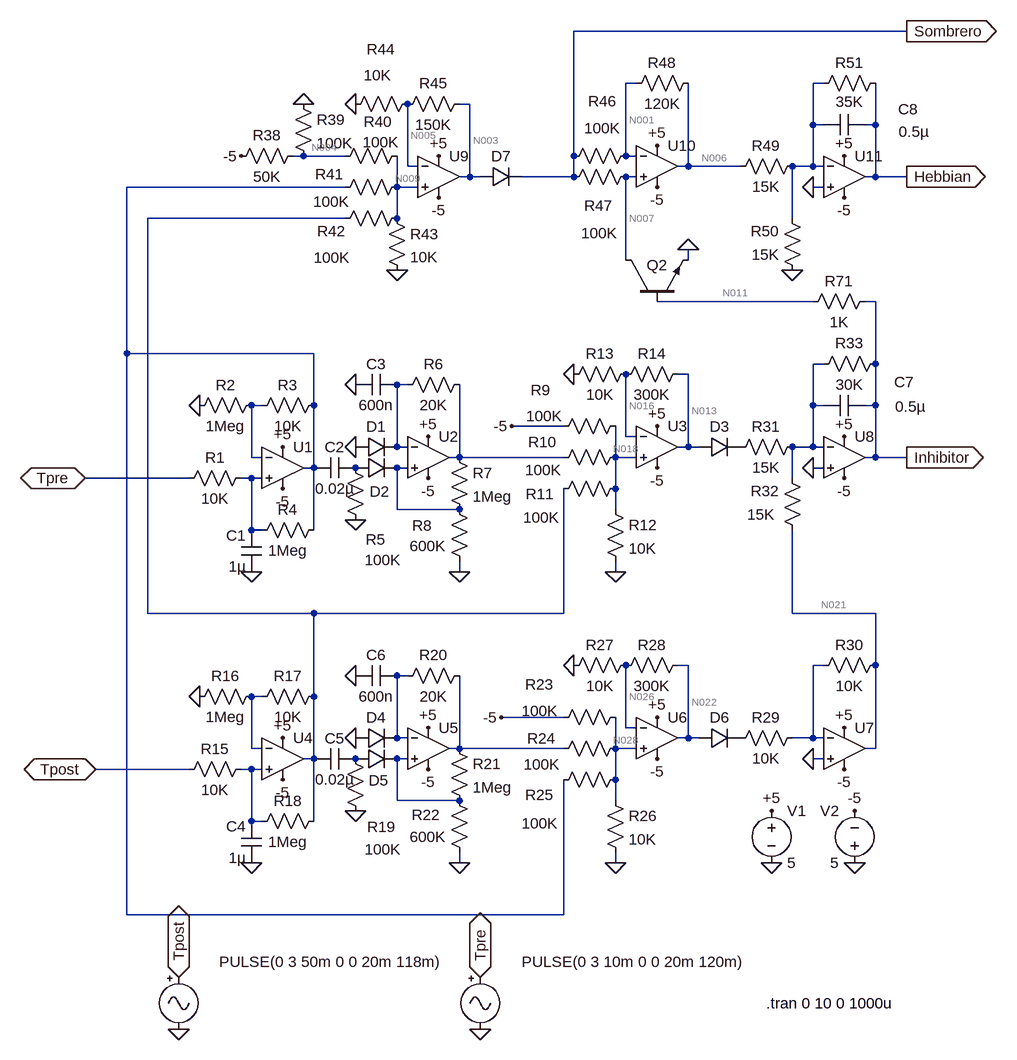
[diagram p0: schematic In-Ex-Pulse.asc]
In-Ex-Pulse.asc, the LTspice schematic file:
Version 4
SHEET 1 2784 1552
WIRE 1184 -672 672 -672
WIRE 768 -592 752 -592
WIRE 1056 -592 1040 -592
WIRE 512 -560 496 -560
WIRE 1040 -528 1040 -592
WIRE 1056 -528 1040 -528
WIRE 1136 -528 1136 -592
WIRE 1136 -528 1120 -528
WIRE 256 -480 240 -480
WIRE 320 -480 256 -480
WIRE 672 -480 672 -672
WIRE 752 -480 752 -592
WIRE 768 -480 752 -480
WIRE 416 -464 416 -560
WIRE 432 -464 416 -464
WIRE 848 -464 848 -592
WIRE 848 -464 832 -464
WIRE 928 -464 848 -464
WIRE 1040 -464 1040 -528
WIRE 1040 -464 1008 -464
WIRE 1056 -464 1040 -464
WIRE 512 -448 512 -560
WIRE 512 -448 496 -448
WIRE 528 -448 512 -448
WIRE 672 -448 672 -480
WIRE 672 -448 592 -448
WIRE 768 -448 752 -448
WIRE 1136 -448 1136 -528
WIRE 1136 -448 1120 -448
WIRE 1184 -448 1136 -448
WIRE 320 -432 -16 -432
WIRE 400 -432 400 -480
WIRE 432 -432 400 -432
WIRE 1056 -432 1040 -432
WIRE 320 -384 16 -384
WIRE 400 -384 400 -432
WIRE 1008 -384 1008 -464
WIRE 752 -320 752 -448
WIRE 848 -320 848 -336
WIRE 1040 -256 800 -256
WIRE 1136 -256 1120 -256
WIRE -16 -176 -16 -432
WIRE 272 -176 -16 -176
WIRE 1056 -160 1040 -160
WIRE 1136 -160 1136 -256
WIRE 848 -144 832 -144
WIRE 416 -128 400 -128
WIRE 192 -96 176 -96
WIRE 272 -96 272 -176
WIRE 1040 -96 1040 -160
WIRE 1056 -96 1040 -96
WIRE 1136 -96 1136 -160
WIRE 1136 -96 1120 -96
WIRE 656 -64 576 -64
WIRE 752 -48 752 -144
WIRE 768 -48 752 -48
WIRE 400 -32 400 -128
WIRE 416 -32 400 -32
WIRE 848 -32 848 -144
WIRE 848 -32 832 -32
WIRE 864 -32 848 -32
WIRE 1040 -32 1040 -96
WIRE 1040 -32 1008 -32
WIRE 1056 -32 1040 -32
WIRE 176 -16 176 -96
WIRE 192 -16 176 -16
WIRE 496 -16 496 -128
WIRE 496 -16 480 -16
WIRE 656 -16 496 -16
WIRE 736 -16 736 -64
WIRE 768 -16 736 -16
WIRE 1136 -16 1136 -96
WIRE 1136 -16 1120 -16
WIRE 1184 -16 1136 -16
WIRE 272 0 272 -96
WIRE 272 0 256 0
WIRE 416 0 400 0
WIRE 1056 0 1040 0
WIRE 80 16 -80 16
WIRE 176 16 160 16
WIRE 192 16 176 16
WIRE 1008 16 1008 -32
WIRE 736 32 736 -16
WIRE 400 64 400 0
WIRE 496 64 400 64
WIRE 736 64 736 32
WIRE 176 96 176 16
WIRE 192 96 176 96
WIRE 272 96 272 0
WIRE 496 160 496 144
WIRE 736 160 736 144
WIRE 16 224 16 -384
WIRE 272 224 16 224
WIRE 656 224 656 32
WIRE 656 224 272 224
WIRE 1008 224 1008 96
WIRE 1136 224 1008 224
WIRE 848 304 832 304
WIRE 1056 304 1040 304
WIRE 1136 304 1136 224
WIRE 416 320 400 320
WIRE 192 352 176 352
WIRE 272 352 272 224
WIRE 656 384 560 384
WIRE 752 400 752 304
WIRE 768 400 752 400
WIRE 400 416 400 320
WIRE 416 416 400 416
WIRE 848 416 848 304
WIRE 848 416 832 416
WIRE 864 416 848 416
WIRE 1040 416 1040 304
WIRE 1040 416 1008 416
WIRE 1056 416 1040 416
WIRE 176 432 176 352
WIRE 192 432 176 432
WIRE 496 432 496 320
WIRE 496 432 480 432
WIRE 656 432 496 432
WIRE 736 432 736 384
WIRE 768 432 736 432
WIRE 1136 432 1136 304
WIRE 1136 432 1120 432
WIRE 272 448 272 352
WIRE 272 448 256 448
WIRE 416 448 400 448
WIRE 1056 448 1040 448
WIRE 80 464 -64 464
WIRE 176 464 160 464
WIRE 192 464 176 464
WIRE 736 480 736 432
WIRE 400 512 400 448
WIRE 496 512 400 512
WIRE 736 512 736 480
WIRE 176 544 176 464
WIRE 192 544 176 544
WIRE 272 544 272 448
WIRE 496 608 496 592
WIRE 736 608 736 592
WIRE -16 688 -16 -176
WIRE 656 688 656 480
WIRE 656 688 -16 688
FLAG 800 -64 +5
FLAG 800 0 -5
FLAG 528 864 0
FLAG 64 864 0
FLAG 224 -32 +5
FLAG 224 32 -5
FLAG 448 -48 +5
FLAG 448 16 -5
FLAG 336 -32 0
FLAG 336 -128 0
FLAG 336 80 0
FLAG 672 -144 0
FLAG 576 -64 -5
FLAG 448 400 +5
FLAG 448 464 -5
FLAG 336 416 0
FLAG 336 320 0
FLAG 336 528 0
FLAG 496 608 0
FLAG 496 160 0
FLAG 800 384 +5
FLAG 800 448 -5
FLAG 672 304 0
FLAG 560 384 -5
FLAG 176 160 0
FLAG 96 -96 0
FLAG 224 416 +5
FLAG 224 480 -5
FLAG 176 608 0
FLAG 96 352 0
FLAG 1088 -48 +5
FLAG 1088 16 -5
FLAG 1088 400 +5
FLAG 1088 464 -5
FLAG 1040 448 0
FLAG 1040 0 0
FLAG 736 160 0
FLAG 736 608 0
FLAG 1184 -16 Inhibitor
IOPIN 1184 -16 Out
FLAG 464 -480 +5
FLAG 464 -416 -5
FLAG 336 -560 0
FLAG 256 -560 0
FLAG 800 -496 +5
FLAG 800 -432 -5
FLAG 160 -480 -5
FLAG 1088 -480 +5
FLAG 1088 -416 -5
FLAG 1040 -432 0
FLAG 1008 -304 0
FLAG 848 -336 0
FLAG 1184 -448 Hebbian
IOPIN 1184 -448 Out
FLAG 1184 -672 Sombrero
IOPIN 1184 -672 Out
FLAG 976 608 0
FLAG 1104 608 0
FLAG 1104 528 -5
FLAG 976 528 +5
FLAG -64 464 Tpost
IOPIN -64 464 BiDir
FLAG 64 784 Tpost
IOPIN 64 784 BiDir
FLAG -80 16 Tpre
IOPIN -80 16 BiDir
FLAG 528 784 Tpre
IOPIN 528 784 BiDir
FLAG 400 -304 0
SYMBOL Opamps\\UniversalOpamp2 800 -32 R0
SYMATTR InstName U3
SYMBOL res 848 -160 R90
WINDOW 0 0 56 VBottom 2
WINDOW 3 32 56 VTop 2
SYMATTR InstName R14
SYMATTR Value 300K
SYMBOL res 720 48 R0
SYMATTR InstName R12
SYMATTR Value 10K
SYMBOL res 752 -32 R90
WINDOW 0 8 128 VBottom 2
WINDOW 3 20 127 VTop 2
SYMATTR InstName R10
SYMATTR Value 100K
SYMBOL Opamps\\UniversalOpamp2 224 0 R0
SYMATTR InstName U1
SYMBOL cap 192 160 R180
WINDOW 0 24 56 Left 2
WINDOW 3 24 8 Left 2
SYMATTR InstName C1
SYMATTR Value 1µ
SYMBOL res 176 0 R90
WINDOW 0 0 56 VBottom 2
WINDOW 3 32 56 VTop 2
SYMATTR InstName R1
SYMATTR Value 10K
SYMBOL res 176 448 R90
WINDOW 0 0 56 VBottom 2
WINDOW 3 32 56 VTop 2
SYMATTR InstName R15
SYMATTR Value 10K
SYMBOL res 288 -112 R90
WINDOW 0 0 56 VBottom 2
WINDOW 3 32 56 VTop 2
SYMATTR InstName R3
SYMATTR Value 10K
SYMBOL res 752 16 R90
WINDOW 0 40 132 VBottom 2
WINDOW 3 45 130 VTop 2
SYMATTR InstName R11
SYMATTR Value 100K
SYMBOL Opamps\\UniversalOpamp2 448 -16 R0
SYMATTR InstName U2
SYMBOL diode 336 -16 R270
WINDOW 0 32 32 VTop 2
WINDOW 3 0 32 Invisible 2
SYMATTR InstName D1
SYMBOL diode 336 16 R270
WINDOW 0 -36 37 VTop 2
WINDOW 3 0 32 Invisible 2
SYMATTR InstName D2
SYMBOL res 480 -32 R0
SYMATTR InstName R7
SYMATTR Value 1Meg
SYMBOL res 512 160 R180
WINDOW 0 58 71 Left 2
WINDOW 3 36 40 Left 2
SYMATTR InstName R8
SYMATTR Value 600K
SYMBOL res 320 -16 R0
WINDOW 0 32 126 Left 2
WINDOW 3 30 158 Left 2
SYMATTR InstName R5
SYMATTR Value 100K
SYMBOL cap 336 -16 R90
WINDOW 0 0 32 VBottom 2
WINDOW 3 32 32 VTop 2
SYMATTR InstName C2
SYMATTR Value 0.02µ
SYMBOL res 512 -144 R90
WINDOW 0 0 56 VBottom 2
WINDOW 3 32 56 VTop 2
SYMATTR InstName R6
SYMATTR Value 20K
SYMBOL cap 400 -144 R90
WINDOW 0 0 32 VBottom 2
WINDOW 3 32 32 VTop 2
SYMATTR InstName C3
SYMATTR Value 600n
SYMBOL res 656 -128 R270
WINDOW 0 32 56 VTop 2
WINDOW 3 0 56 VBottom 2
SYMATTR InstName R13
SYMATTR Value 10K
SYMBOL diode 864 -16 R270
WINDOW 0 32 32 VTop 2
WINDOW 3 0 32 Invisible 2
SYMATTR InstName D3
SYMBOL res 752 -80 R90
WINDOW 0 -24 131 VBottom 2
WINDOW 3 -15 125 VTop 2
SYMATTR InstName R9
SYMATTR Value 100K
SYMBOL Opamps\\UniversalOpamp2 448 432 R0
SYMATTR InstName U5
SYMBOL diode 336 432 R270
WINDOW 0 32 32 VTop 2
WINDOW 3 0 32 Invisible 2
SYMATTR InstName D4
SYMBOL diode 336 464 R270
WINDOW 0 -33 36 VTop 2
WINDOW 3 0 32 Invisible 2
SYMATTR InstName D5
SYMBOL res 480 416 R0
SYMATTR InstName R21
SYMATTR Value 1Meg
SYMBOL res 512 608 R180
WINDOW 0 45 74 Left 2
WINDOW 3 36 40 Left 2
SYMATTR InstName R22
SYMATTR Value 600K
SYMBOL res 320 432 R0
WINDOW 0 34 121 Left 2
WINDOW 3 30 155 Left 2
SYMATTR InstName R19
SYMATTR Value 100K
SYMBOL res 512 304 R90
WINDOW 0 0 56 VBottom 2
WINDOW 3 32 56 VTop 2
SYMATTR InstName R20
SYMATTR Value 20K
SYMBOL cap 400 304 R90
WINDOW 0 0 32 VBottom 2
WINDOW 3 32 32 VTop 2
SYMATTR InstName C6
SYMATTR Value 600n
SYMBOL cap 336 432 R90
WINDOW 0 0 32 VBottom 2
WINDOW 3 32 32 VTop 2
SYMATTR InstName C5
SYMATTR Value 0.02µ
SYMBOL Opamps\\UniversalOpamp2 800 416 R0
SYMATTR InstName U6
SYMBOL res 848 288 R90
WINDOW 0 0 56 VBottom 2
WINDOW 3 32 56 VTop 2
SYMATTR InstName R28
SYMATTR Value 300K
SYMBOL res 720 496 R0
SYMATTR InstName R26
SYMATTR Value 10K
SYMBOL res 752 416 R90
WINDOW 0 16 130 VBottom 2
WINDOW 3 25 129 VTop 2
SYMATTR InstName R24
SYMATTR Value 100K
SYMBOL res 752 464 R90
WINDOW 0 55 133 VBottom 2
WINDOW 3 68 132 VTop 2
SYMATTR InstName R25
SYMATTR Value 100K
SYMBOL res 656 320 R270
WINDOW 0 32 56 VTop 2
WINDOW 3 0 56 VBottom 2
SYMATTR InstName R27
SYMATTR Value 10K
SYMBOL diode 864 432 R270
WINDOW 0 32 32 VTop 2
WINDOW 3 0 32 Invisible 2
SYMATTR InstName D6
SYMBOL res 752 368 R90
WINDOW 0 -19 133 VBottom 2
WINDOW 3 -9 132 VTop 2
SYMATTR InstName R23
SYMATTR Value 100K
SYMBOL res 1152 -176 R90
WINDOW 0 0 56 VBottom 2
WINDOW 3 32 56 VTop 2
SYMATTR InstName R33
SYMATTR Value 30K
SYMBOL res 1024 -48 R90
WINDOW 0 0 56 VBottom 2
WINDOW 3 32 56 VTop 2
SYMATTR InstName R31
SYMATTR Value 15K
SYMBOL res 1024 112 R180
WINDOW 0 36 76 Left 2
WINDOW 3 43 40 Left 2
SYMATTR InstName R32
SYMATTR Value 15K
SYMBOL res 288 80 R90
WINDOW 0 0 56 VBottom 2
WINDOW 3 32 56 VTop 2
SYMATTR InstName R4
SYMATTR Value 1Meg
SYMBOL res 192 -112 R90
WINDOW 0 0 56 VBottom 2
WINDOW 3 32 56 VTop 2
SYMATTR InstName R2
SYMATTR Value 1Meg
SYMBOL Opamps\\UniversalOpamp2 224 448 R0
SYMATTR InstName U4
SYMBOL cap 192 608 R180
WINDOW 0 24 56 Left 2
WINDOW 3 24 8 Left 2
SYMATTR InstName C4
SYMATTR Value 1µ
SYMBOL res 288 336 R90
WINDOW 0 0 56 VBottom 2
WINDOW 3 32 56 VTop 2
SYMATTR InstName R17
SYMATTR Value 10K
SYMBOL res 288 528 R90
WINDOW 0 0 56 VBottom 2
WINDOW 3 32 56 VTop 2
SYMATTR InstName R18
SYMATTR Value 1Meg
SYMBOL res 192 336 R90
WINDOW 0 0 56 VBottom 2
WINDOW 3 32 56 VTop 2
SYMATTR InstName R16
SYMATTR Value 1Meg
SYMBOL Opamps\\UniversalOpamp2 1088 -16 R0
SYMATTR InstName U8
SYMBOL res 1152 288 R90
WINDOW 0 0 56 VBottom 2
WINDOW 3 32 56 VTop 2
SYMATTR InstName R30
SYMATTR Value 10K
SYMBOL Opamps\\UniversalOpamp2 1088 432 R0
SYMATTR InstName U7
SYMBOL res 1024 400 R90
WINDOW 0 0 56 VBottom 2
WINDOW 3 32 56 VTop 2
SYMATTR InstName R29
SYMATTR Value 10K
SYMBOL cap 1120 -112 R90
WINDOW 0 -4 -60 VBottom 2
WINDOW 3 2 -70 VTop 2
SYMATTR InstName C7
SYMATTR Value 0.5µ
SYMBOL Opamps\\UniversalOpamp2 464 -448 R0
SYMATTR InstName U9
SYMBOL res 512 -576 R90
WINDOW 0 0 56 VBottom 2
WINDOW 3 32 56 VTop 2
SYMATTR InstName R45
SYMATTR Value 150K
SYMBOL res 384 -400 R0
SYMATTR InstName R43
SYMATTR Value 10K
SYMBOL res 416 -448 R90
WINDOW 0 12 120 VBottom 2
WINDOW 3 23 117 VTop 2
SYMATTR InstName R41
SYMATTR Value 100K
SYMBOL res 320 -544 R270
WINDOW 0 85 55 VTop 2
WINDOW 3 76 50 VBottom 2
SYMATTR InstName R44
SYMATTR Value 10K
SYMBOL res 416 -496 R90
WINDOW 0 -21 45 VBottom 2
WINDOW 3 -21 41 VTop 2
SYMATTR InstName R40
SYMATTR Value 100K
SYMBOL res 240 -576 R0
SYMATTR InstName R39
SYMATTR Value 100K
SYMBOL res 256 -496 R90
WINDOW 0 0 56 VBottom 2
WINDOW 3 32 56 VTop 2
SYMATTR InstName R38
SYMATTR Value 50K
SYMBOL diode 528 -432 R270
WINDOW 0 32 32 VTop 2
WINDOW 3 0 32 Invisible 2
SYMATTR InstName D7
SYMBOL res 864 -608 R90
WINDOW 0 0 56 VBottom 2
WINDOW 3 32 56 VTop 2
SYMATTR InstName R48
SYMATTR Value 120K
SYMBOL Opamps\\UniversalOpamp2 800 -464 R0
SYMATTR InstName U10
SYMBOL res 768 -496 R90
WINDOW 0 -53 52 VBottom 2
WINDOW 3 -42 52 VTop 2
SYMATTR InstName R46
SYMATTR Value 100K
SYMBOL res 768 -464 R90
WINDOW 0 76 58 VBottom 2
WINDOW 3 87 57 VTop 2
SYMATTR InstName R47
SYMATTR Value 100K
SYMBOL npn 752 -256 R270
WINDOW 0 56 32 VRight 2
WINDOW 3 56 68 Invisible 2
SYMATTR InstName Q2
SYMBOL res 1152 -608 R90
WINDOW 0 0 56 VBottom 2
WINDOW 3 60 56 VBottom 2
SYMATTR InstName R51
SYMATTR Value 35K
SYMBOL res 1024 -480 R90
WINDOW 0 0 56 VBottom 2
WINDOW 3 32 56 VTop 2
SYMATTR InstName R49
SYMATTR Value 15K
SYMBOL res 1024 -288 R180
WINDOW 0 36 76 Left 2
WINDOW 3 36 40 Left 2
SYMATTR InstName R50
SYMATTR Value 15K
SYMBOL Opamps\\UniversalOpamp2 1088 -448 R0
SYMATTR InstName U11
SYMBOL cap 1120 -544 R90
WINDOW 0 8 -66 VBottom 2
WINDOW 3 11 -75 VTop 2
SYMATTR InstName C8
SYMATTR Value 0.5µ
SYMBOL res 1024 -240 R270
WINDOW 0 32 56 VTop 2
WINDOW 3 0 56 VBottom 2
SYMATTR InstName R71
SYMATTR Value 1K
SYMBOL voltage 976 512 R0
WINDOW 123 0 0 Left 2
WINDOW 39 0 0 Left 2
SYMATTR InstName V1
SYMATTR Value 5
SYMBOL voltage 1104 624 R180
WINDOW 0 24 96 Left 2
WINDOW 3 24 16 Left 2
WINDOW 123 0 0 Left 2
WINDOW 39 0 0 Left 2
SYMATTR InstName V2
SYMATTR Value 5
SYMBOL Misc\\signal 64 768 R0
WINDOW 0 24 16 Invisible 2
WINDOW 3 62 -8 Left 2
WINDOW 123 0 0 Left 2
WINDOW 39 0 0 Left 2
SYMATTR InstName V3
SYMATTR Value PULSE(0 3 50m 0 0 20m 118m)
SYMBOL Misc\\signal 528 768 R0
WINDOW 0 24 16 Invisible 2
WINDOW 3 64 -8 Left 2
WINDOW 123 0 0 Left 2
WINDOW 39 0 0 Left 2
SYMATTR InstName V4
SYMATTR Value PULSE(0 3 10m 0 0 20m 120m)
SYMBOL res 416 -400 R90
WINDOW 0 51 117 VBottom 2
WINDOW 3 61 116 VTop 2
SYMATTR InstName R42
SYMATTR Value 100K
TEXT 968 824 Left 2 !.tran 0 10 0 1000u

The netlist it stands for:
* In-Ex-Pulse.asc
XU3 N018 N016 +5 -5 N013 level.2 Avol=1Meg GBW=10Meg Slew=10Meg ilimit=25m rail=0 Vos=0 phimargin=45 en=0 enk=0 in=0 ink=0 Rin=500Meg  ; pins IN+ IN- V+ V- OUT
R14 N013 N016 300K
R12 N018 0 10K
R10 N018 N017 100K
XU1 N020 N015 +5 -5 N008 level.2 Avol=1Meg GBW=10Meg Slew=10Meg ilimit=25m rail=0 Vos=0 phimargin=45 en=0 enk=0 in=0 ink=0 Rin=500Meg  ; pins IN+ IN- V+ V- OUT
C1 0 N020 1µ
R1 N020 Tpre 10K
R15 N030 Tpost 10K
R3 N008 N015 10K
R11 N018 N010 100K
XU2 N019 N014 +5 -5 N017 level.2 Avol=1Meg GBW=10Meg Slew=10Meg ilimit=25m rail=0 Vos=0 phimargin=45 en=0 enk=0 in=0 ink=0 Rin=500Meg  ; pins IN+ IN- V+ V- OUT
D1 0 N014 D
D2 P001 N019 D
R7 N017 N019 1Meg
R8 0 N019 600K
R5 P001 0 100K
C2 P001 N008 0.02µ
R6 N017 N014 20K
C3 N014 0 600n
R13 0 N016 10K
D3 N013 P002 D
R9 N018 -5 100K
XU5 N029 N024 +5 -5 N027 level.2 Avol=1Meg GBW=10Meg Slew=10Meg ilimit=25m rail=0 Vos=0 phimargin=45 en=0 enk=0 in=0 ink=0 Rin=500Meg  ; pins IN+ IN- V+ V- OUT
D4 0 N024 D
D5 P003 N029 D
R21 N027 N029 1Meg
R22 0 N029 600K
R19 P003 0 100K
R20 N027 N024 20K
C6 N024 0 600n
C5 P003 N010 0.02µ
XU6 N028 N026 +5 -5 N022 level.2 Avol=1Meg GBW=10Meg Slew=10Meg ilimit=25m rail=0 Vos=0 phimargin=45 en=0 enk=0 in=0 ink=0 Rin=500Meg  ; pins IN+ IN- V+ V- OUT
R28 N022 N026 300K
R26 N028 0 10K
R24 N028 N027 100K
R25 N028 N008 100K
R27 0 N026 10K
D6 N022 P004 D
R23 N028 -5 100K
R33 Inhibitor N012 30K
R31 N012 P002 15K
R32 N021 N012 15K
R4 N008 N020 1Meg
R2 N015 0 1Meg
XU4 N030 N025 +5 -5 N010 level.2 Avol=1Meg GBW=10Meg Slew=10Meg ilimit=25m rail=0 Vos=0 phimargin=45 en=0 enk=0 in=0 ink=0 Rin=500Meg  ; pins IN+ IN- V+ V- OUT
C4 0 N030 1µ
R17 N010 N025 10K
R18 N010 N030 1Meg
R16 N025 0 1Meg
XU8 0 N012 +5 -5 Inhibitor level.2 Avol=1Meg GBW=10Meg Slew=10Meg ilimit=25m rail=0 Vos=0 phimargin=45 en=0 enk=0 in=0 ink=0 Rin=500Meg  ; pins IN+ IN- V+ V- OUT
R30 N021 N023 10K
XU7 0 N023 +5 -5 N021 level.2 Avol=1Meg GBW=10Meg Slew=10Meg ilimit=25m rail=0 Vos=0 phimargin=45 en=0 enk=0 in=0 ink=0 Rin=500Meg  ; pins IN+ IN- V+ V- OUT
R29 N023 P004 10K
C7 Inhibitor N012 0.5µ
XU9 N009 N005 +5 -5 N003 level.2 Avol=1Meg GBW=10Meg Slew=10Meg ilimit=25m rail=0 Vos=0 phimargin=45 en=0 enk=0 in=0 ink=0 Rin=500Meg  ; pins IN+ IN- V+ V- OUT
R45 N003 N005 150K
R43 N009 0 10K
R41 N009 N008 100K
R44 0 N005 10K
R40 N009 N004 100K
R39 0 N004 100K
R38 N004 -5 50K
D7 N003 Sombrero D
R48 N006 N001 120K
XU10 N007 N001 +5 -5 N006 level.2 Avol=1Meg GBW=10Meg Slew=10Meg ilimit=25m rail=0 Vos=0 phimargin=45 en=0 enk=0 in=0 ink=0 Rin=500Meg  ; pins IN+ IN- V+ V- OUT
R46 N001 Sombrero 100K
R47 N007 Sombrero 100K
Q2 N007 N011 0 0 NPN
R51 Hebbian N002 35K
R49 N002 N006 15K
R50 0 N002 15K
XU11 0 N002 +5 -5 Hebbian level.2 Avol=1Meg GBW=10Meg Slew=10Meg ilimit=25m rail=0 Vos=0 phimargin=45 en=0 enk=0 in=0 ink=0 Rin=500Meg  ; pins IN+ IN- V+ V- OUT
C8 Hebbian N002 0.5µ
R71 N011 Inhibitor 1K
V1 +5 0 5
V2 0 -5 5
V3 Tpost 0 PULSE(0 3 50m 0 0 20m 118m)
V4 Tpre 0 PULSE(0 3 10m 0 0 20m 120m)
R42 N009 N010 100K
.model D D
.lib standard.dio
.model NPN NPN
.model PNP PNP
.lib standard.bjt
.tran 0 10 0 1000u
.lib UniversalOpamps2.sub
.backanno
.end

* Results of the author's LTspice run, read from the files saved beside the schematic
* Operating Point, zero values left out:
*   V(n013) = -5 V
*   V(+5) = 5 V
*   V(-5) = -5 V
*   V(n016) = -161.3 mV
*   V(n018) = -384.6 mV
*   V(p002) = -75.15 nV
*   V(n022) = -5 V
*   V(n026) = -161.3 mV
*   V(n028) = -384.6 mV
*   V(p004) = -50.1 nV
*   V(inhibitor) = 50.1 nV
*   V(n021) = 50.1 nV
*   V(n003) = -3.137 V
*   V(n005) = -196.1 mV
*   V(n009) = -196.1 mV
*   V(n004) = -2.549 V
*   V(sombrero) = -784.4 µV
*   V(n006) = -784.2 µV
*   V(n001) = -784.2 µV
*   V(n007) = -784.2 µV
*   V(n011) = 50.1 nV
*   V(hebbian) = 1.83 mV
*   I(D7) = -3.146 pA
*   I(D6) = -5.01 pA
*   I(D3) = -5.01 pA
*   I(R42) = -1.961 µA
*   I(R49) = 52.28 nA
*   I(R51) = 52.28 nA
*   I(R47) = 1.569 pA
*   I(R46) = 1.577 pA
*   I(R38) = 49.02 µA
*   I(R39) = 25.49 µA
*   I(R40) = 23.53 µA
*   I(R44) = 19.61 µA
*   I(R41) = -1.961 µA
*   I(R43) = -19.61 µA
*   I(R45) = -19.61 µA
*   I(R29) = 5.01 pA
*   I(R30) = 5.01 pA
*   I(R32) = 3.34 pA
*   I(R31) = 5.01 pA
*   I(R33) = 1.67 pA
*   I(R23) = 46.15 µA
*   I(R27) = 16.13 µA
*   I(R25) = -3.846 µA
*   I(R24) = -3.846 µA
*   I(R26) = -38.46 µA
*   I(R28) = -16.13 µA
*   I(R9) = 46.15 µA
*   I(R13) = 16.13 µA
*   I(R11) = -3.846 µA
*   I(R10) = -3.846 µA
*   I(R12) = -38.46 µA
*   I(R14) = -16.13 µA
*   I(V2) = -4.565 mA
*   I(V1) = -4.391 mA